# EAGLE design MoteBreakout (EAGLE 8.1.0)
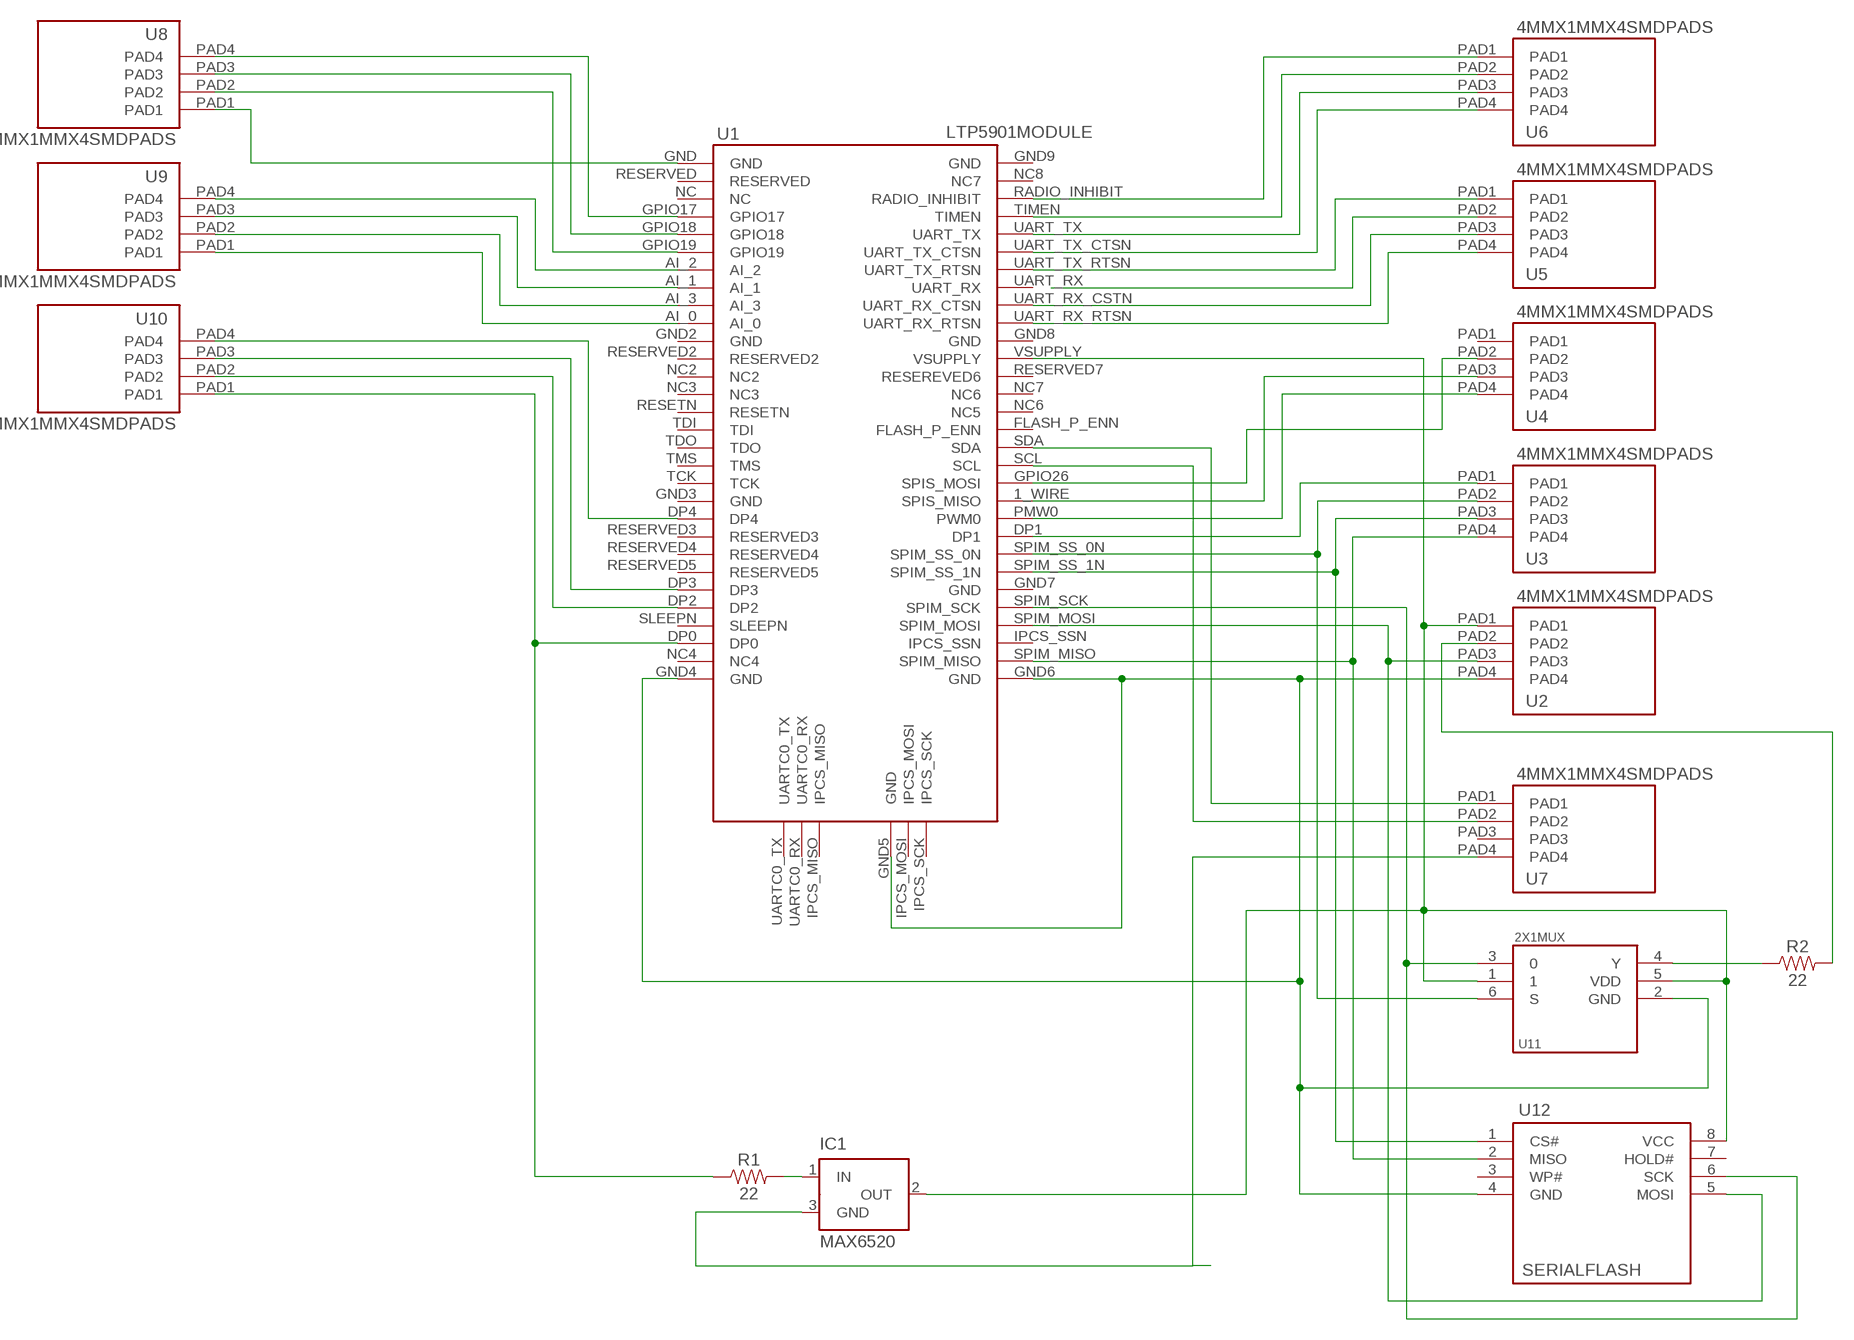
[diagram p0: schematic, sheet 1]

## Parts
IC1  MAX6520  [SOT23]
R1  22  22OHM-0603-1/10W-1%  [0603]
R2  22  22OHM-0603-1/10W-1%  [0603]
U1  LTP5901MODULE  [LTP5901]
U2  4MMX1MMX4SMDPADS  [4MMX1MMX4SMD]
U3  4MMX1MMX4SMDPADS  [4MMX1MMX4SMD]
U4  4MMX1MMX4SMDPADS  [4MMX1MMX4SMD]
U5  4MMX1MMX4SMDPADS  [4MMX1MMX4SMD]
U6  4MMX1MMX4SMDPADS  [4MMX1MMX4SMD]
U7  4MMX1MMX4SMDPADS  [4MMX1MMX4SMD]
U8  4MMX1MMX4SMDPADS  [4MMX1MMX4SMD]
U9  4MMX1MMX4SMDPADS  [4MMX1MMX4SMD]
U10  4MMX1MMX4SMDPADS  [4MMX1MMX4SMD]
U11  2X1MUX  [SOT457]
U12  SERIALFLASH  [8S2]

## Nets
N$1: U1.GND4(GND) U1.GND5(GND) U1.GND6(GND) U2.PAD4 U11.2(GND) U12.4(GND)
N$2: U1.SPIM_MOSI U2.PAD3 U12.5(MOSI)
N$3: U1.SPIM_SCK U11.3 U12.6(SCK)
N$4: IC1.2(OUT) U1.VSUPPLY U2.PAD1 U11.1 U11.5(VDD) U12.8(VCC)
N$5: U1.SPIM_MISO U3.PAD4 U12.2(MISO)
N$6: U1.SPIM_SS_1N U3.PAD3 U12.1(CS#)
N$7: U1.SPIM_SS_0N U3.PAD2 U11.6(S)
N$8: U1.DP1 U3.PAD1
N$9: U1.PMW0(PWM0) U4.PAD4
N$10: U1.1_WIRE(SPIS_MISO) U4.PAD3
N$11: U1.GPIO26(SPIS_MOSI) U4.PAD2
N$12: U1.UART_RX_RTSN U5.PAD4
N$13: U1.UART_RX_CSTN(UART_RX_CTSN) U5.PAD3
N$14: U5.PAD2
N$15: U1.UART_TX_RTSN U5.PAD1
N$16: U1.UART_TX_CTSN U6.PAD4
N$17: U1.UART_TX U6.PAD3
N$18: U1.TIMEN U6.PAD2
N$19: U1.RADIO_INHIBIT U6.PAD1
N$20: U1.GND U8.PAD1
N$21: U1.SDA U7.PAD1
N$22: U1.SCL U7.PAD2
N$23: IC1.3(GND) U7.PAD4
N$25: U1.GPIO17 U8.PAD4
N$26: U1.GPIO18 U8.PAD3
N$27: U1.GPIO19 U8.PAD2
N$28: U1.AI_2 U9.PAD4
N$29: U1.AI_1 U9.PAD3
N$30: U1.AI_3 U9.PAD2
N$31: U1.AI_0 U9.PAD1
N$32: U1.DP4 U10.PAD4
N$33: U1.DP3 U10.PAD3
N$34: U1.DP2 U10.PAD2
N$35: R1.1 U1.DP0 U10.PAD1
N$36: R2.2 U2.PAD2
N$37: R2.1 U11.4(Y)
N$39: IC1.1(IN) R1.2
Unconnected: U1.FLASH_P_ENN U1.IPCS_MISO U1.IPCS_MOSI U1.IPCS_SCK U1.IPCS_SSN U1.NC U1.NC2 U1.NC3 U1.NC4 U1.NC6(NC5) U1.NC7(NC6) U1.NC8(NC7) U1.RESERVED U1.RESERVED2 U1.RESERVED3 U1.RESERVED4 U1.RESERVED5 U1.RESERVED7(RESEREVED6) U1.RESETN U1.SLEEPN U1.TCK U1.TDI U1.TDO U1.TMS U1.UART_RX U1.UARTC0_RX U1.UARTC0_TX U4.PAD1 U7.PAD3 U12.3(WP#) U12.7(HOLD#)

## Power pins joined to a net without a drawn wire
GND: U1.GND2(GND) U1.GND3(GND) U1.GND7(GND) U1.GND8(GND) U1.GND9(GND)

## Library data of the parts
IC1 = maxim:MAX6520: 1.2V Voltage Reference 50ppm/°C, SOT23, 3-Terminal Source: Data sheet <http://datasheets.maxim-ic.com/en/ds/MAX6520.pdf>; MF: MAXIM; MPN: MAX6520EUR-T; OC_FARNELL: unknown; OC_NEWARK: 02J4586
R1 R2 = SparkFun-Resistors:22OHM: 22Ω resistor A resistor is a passive two-terminal electrical component that implements electrical resistance as a circuit element. Resistors act to reduce current flow, and, at the same time, act to lower voltage levels within circuits. - Wikipedia; PROD_ID: RES-08698
U1 = Dust:LTP5901: SmartMesh LTP5901 Module
U2-U10 = Dust:4MMX1MMX4SMD: 4mm x 1mm x 4 SMD Pads
U11 = nxp_60:2X1MUX: 2x1MUX - NXP 74LVC1G157
U12 = Dust:SERIALFLASH: Cypress S25FL116K Serial Flash

## Board
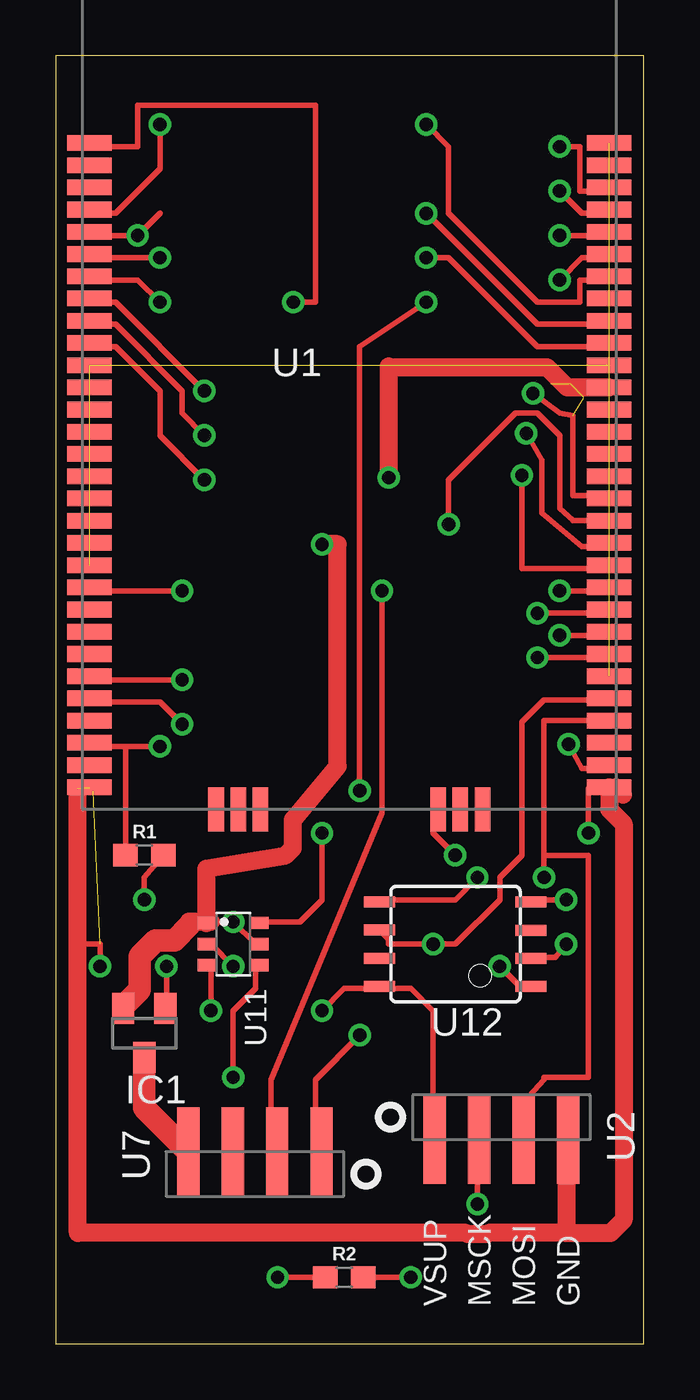
[diagram p1: board, top side]
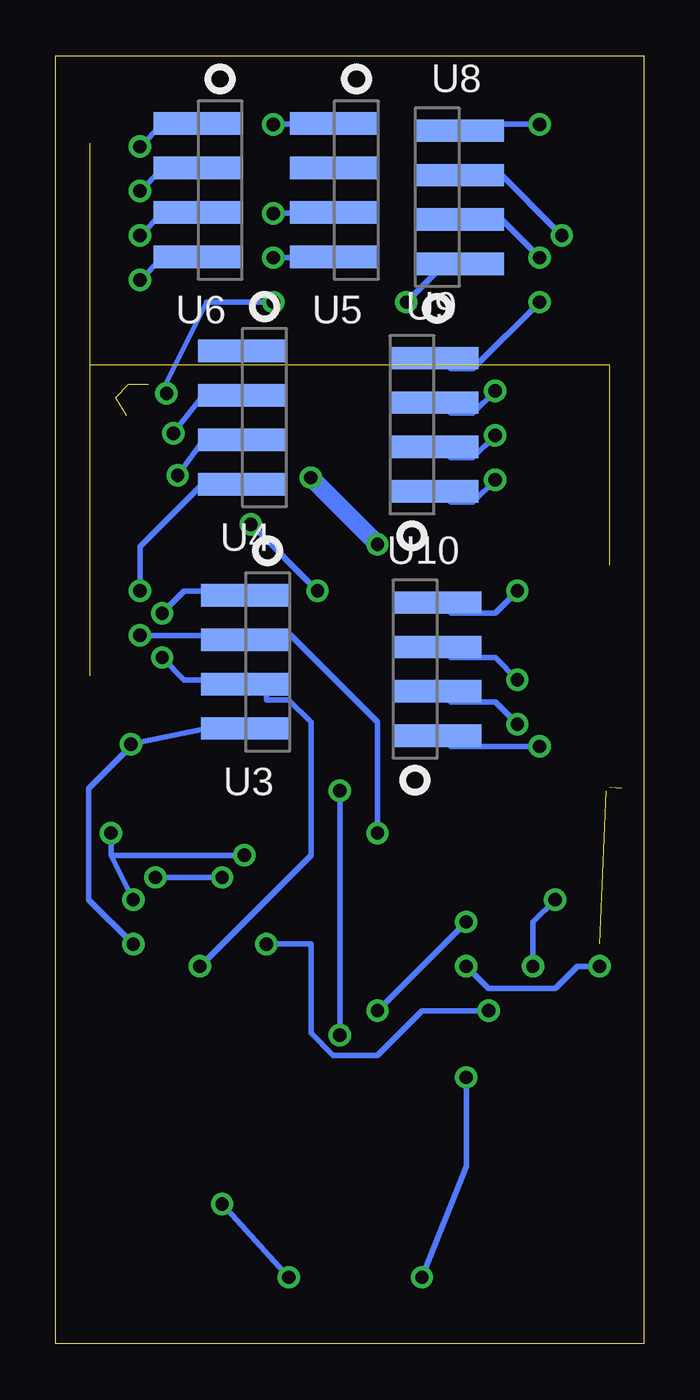
[diagram p2: board, bottom side, seen from below]

Size 26.5 x 58 mm. Coordinates in mm from the lower left corner, seen from the top.
Outline: 0,0 26.5,0 26.5,58 0,58 0,0
Copper layers (1*16): Top 0.035mm / dielectric 1.5mm / Bottom 0.035mm
Design rules "default *": minimum track width 10mil, minimum drill 12mil, track to track 6mil, track to pad 6mil, pad to pad 6mil, via to via 6mil, smd to smd 6mil, copper to edge 20mil, drill to drill 8mil, minimum pad ring 10mil, minimum via ring 8mil, stop-mask expansion 4mil, vias tented up to drill 0mil, thermal gap 10mil

### Footprints (pad centres in the part's own frame; a part is rotated, then mirrored left to right if it is on the bottom)
SOT23 = smd 1 x 1.4: 1 -0.95,-1.1; 2 0.95,-1.1; 3 0,1.1
0603 = smd 1.1 x 1: 1 -0.85,0; 2 0.85,0
LTP5901 = smd 2 x 0.7: 1_WIRE 11.7,-10; AI_0 -11.7,0; AI_1 -11.7,2; AI_2 -11.7,3; AI_3 -11.7,1; DP0 -11.7,-18; DP1 11.7,-12; DP2 -11.7,-16; DP3 -11.7,-15; DP4 -11.7,-11; FLASH_P_ENN 11.7,-6; GND -11.7,9; GND2 -11.7,-1; GND3 -11.7,-10; GND4 -11.7,-20; GND6 11.7,-20; GND7 11.7,-15; GND8 11.7,-1; GND9 11.7,9; GPIO17 -11.7,6; GPIO18 -11.7,5; GPIO19 -11.7,4; GPIO26 11.7,-9; IPCS_SSN 11.7,-18; NC -11.7,7; NC2 -11.7,-3; NC3 -11.7,-4; NC4 -11.7,-19; NC6 11.7,-5; NC7 11.7,-4; NC8 11.7,8; PMW0 11.7,-11; RADIO_INHIBIT 11.7,7; RESERVED -11.7,8; RESERVED2 -11.7,-2; RESERVED3 -11.7,-12; RESERVED4 -11.7,-13; RESERVED5 -11.7,-14; RESERVED7 11.7,-3; RESETN -11.7,-5; SCL 11.7,-8; SDA 11.7,-7; SLEEPN -11.7,-17; SPIM_MISO 11.7,-19; SPIM_MOSI 11.7,-17; SPIM_SCK 11.7,-16; SPIM_SS_0N 11.7,-13; SPIM_SS_1N 11.7,-14; TCK -11.7,-9; TDI -11.7,-6; TDO -11.7,-7; TIMEN 11.7,6; TMS -11.7,-8; UART_RX 11.7,2; UART_RX_CSTN 11.7,1; UART_RX_RTSN 11.7,0; UART_TX 11.7,5; UART_TX_CTSN 11.7,4; UART_TX_RTSN 11.7,3; VSUPPLY 11.7,-2 | smd 0.7 x 2: GND5 4,-21; IPCS_MISO -4,-21; IPCS_MOSI 5,-21; IPCS_SCK 6,-21; UARTC0_RX -5,-21; UARTC0_TX -6,-21
4MMX1MMX4SMD = smd 4 x 1: PAD1 -1,3; PAD2 -1,1; PAD3 -1,-1; PAD4 -1,-3
SOT457 = smd 0.55 x 0.8: 1 -0.95,-1.2; 2 0,-1.2; 3 0.95,-1.2; 4 0.95,1.2; 5 0,1.2; 6 -0.95,1.2
8S2 = smd 0.5 x 1.4: 1 -1.905,-3.404; 2 -0.645,-3.404; 3 0.625,-3.404; 4 1.895,-3.404; 5 1.905,3.404; 6 0.635,3.404; 7 -0.635,3.404; 8 -1.905,3.404

### Placement (x,y rotation side)
IC1  4,14 180 top
R1  4,22 0 top
R2  13,3 0 top
U1  13.23,45.06 0 top
U2  20.08,10.21 90 top
U3  16.95,30.7 0 bottom
U4  17.09,41.7 0 bottom
U5  12.95,51.94 0 bottom
U6  19.09,51.94 0 bottom
U7  8.98,7.65 270 top
U8  9.31,51.62 180 bottom
U9  10.45,41.38 180 bottom
U10  10.31,30.38 180 bottom
U11  8,18 270 top
U12  18,18 90 top

### Tracks (layer width: path | path; a pad name or v marks a point on that pad's centre or on a via)
GND  (4 unrouted)
N$1  (via drill 0.6)  (2 unrouted)
  Top 0.254: 1.7,24.9 U1.GND4 | 17.23,23.19 U1.GND5 17,24 17,23 v18,22 | v2,17 2,18 1,18 | v8,17 7,18 U11.2 | U1.GND6 24.06,25.06 24,25 v24,23 | v23,20 22,20 U12.4
  Top 0.813: 25.56,24.73 25.23,25.06 U1.GND6 24.93,24.07 25.59,23.41 25.59,5.59 25,5 23,5 | 23,5 19.5,5 19.44,4.94 18.56,4.94 18.5,5 1,5 1,25 | U2.PAD4 23,9.21 23,5
  Bottom 0.254: v2,17 3,17 4,16 7,16 v8,17 | v24,23 24,22 | 24,22 v23,20 | 24,22 v18,22
N$2  (via drill 0.6)
  Top 0.254: U1.SPIM_MOSI 22,28.06 22,22 | U2.PAD3 21.08,10.9 22,11.9 22,12 24,12 24,22 22,22 | v22,21 22,22 | U12.5 15,20 18,20 v19,21
  Bottom 0.254: v19,21 v22,21
N$3  (via drill 0.6)
  Top 0.254: U11.3 7,17 v7,15 | U12.6 15,18.23 15,18 v17,18 18,18 20,20 20,21 21,22 21,28 22,29 24.87,29 U1.SPIM_SCK
  Bottom 0.254: v7,15 10,15 12,13 14,13 15,14 15,18 v17,18
N$4  (via drill 0.6)
  Top 0.254: 24.96,43.33 U1.VSUPPLY | 3,15 IC1.2 | v12,15 13,16 14,16 U12.8 15,16 16,16 17,15 17,10 U2.PAD1 | 7,19 v8,19 9,18 U11.5
  Top 0.813: U1.VSUPPLY 23.04,43.06 22.14,43.96 15.04,43.96 15,44 v15,39 | v12,36 12.7,36 12.7,26 10.69,23.59 10.69,22.33 10.36,22 6.8,21.4 6.8,19.8 U11.1 7,19 6,19 6.03,18.84
  Top 1.016: IC1.2 3.05,15.2 3.79,15.94 3.79,17.43 4.52,18.16 5.36,18.16 6.03,18.84
  Bottom 0.254: v8,19 v12,15
  Bottom 0.813: v12,36 v15,39
N$5  (via drill 0.6)
  Top 0.254: v23.1,27 23.7,25.9 24.7,25.9 U1.SPIM_MISO | v23,18 22.5,17.4 21.45,17.4 U12.2
  Bottom 0.254: U3.PAD4 19.7,27.7 v23.1,27 23,27 25,25 25,20 v23,18
N$6  (via drill 0.6)
  Top 0.254: v21.7,30.9 24.7,30.9 U1.SPIM_SS_1N | v20,17 21,16 U12.1
  Bottom 0.254: v21.7,30.9 20.7,29.9 18.7,29.9 U3.PAD3 17,30 17,29 16,29 15,28 15,22 v20,17
N$7  (via drill 0.6)
  Top 0.254: U1.SPIM_SS_0N 24.7,31.9 v22.7,31.9 | U11.6 9,19 11,19 12,20 v12,23
  Bottom 0.254: v22.7,31.9 18.7,31.9 U3.PAD2 17,32 16,32 12,28 v12,23
N$8  (via drill 0.6)
  Top 0.254: v21.7,32.9 24.7,32.9 U1.DP1
  Bottom 0.254: v21.7,32.9 20.7,33.9 18.7,33.9 U3.PAD1
N$9  (via drill 0.6)
  Top 0.254: U1.PMW0 24.7,33.9 v22.7,33.9
  Bottom 0.254: v22.7,33.9 22.7,35.9 19.7,38.9 18.7,38.9 U4.PAD4
N$10  (via drill 0.6)
  Top 0.254: U1.1_WIRE 24.7,34.9 21,34.9 v21,39.1
  Bottom 0.254: v21,39.1 19.7,40.9 18.7,40.9 U4.PAD3
N$11  (via drill 0.6)
  Top 0.254: U1.GPIO26 24.7,35.9 23.7,35.9 21.9,37.4 21.9,39.8 v21.2,41
  Bottom 0.254: v21.2,41 19.7,42.9 18.7,42.9 U4.PAD2
N$12  (via drill 0.6)
  Top 0.254: U1.UART_RX_RTSN 24.7,44.9 21.7,44.9 17.7,48.9 v16.7,48.9
  Bottom 0.254: v16.7,48.9 14.7,48.9 U5.PAD4
N$13  (via drill 0.6)
  Top 0.254: U1.UART_RX_CSTN 24.7,45.9 21.7,45.9 v16.7,50.9
  Bottom 0.254: v16.7,50.9 14.7,50.9 U5.PAD3
N$15  (via drill 0.6)
  Top 0.254: U1.UART_TX_RTSN 24.7,47.9 23.6,47.9 23.6,46.9 21.7,46.9 17.7,50.9 17.7,53.9 v16.7,54.9
  Bottom 0.254: v16.7,54.9 14.7,54.9 U5.PAD1
N$16  (via drill 0.6)
  Top 0.254: U1.UART_TX_CTSN 24.7,48.9 23.7,48.9 v22.7,47.9
  Bottom 0.254: v22.7,47.9 21.7,48.9 20.7,48.9 U6.PAD4
N$17  (via drill 0.6)
  Top 0.254: v22.7,49.9 24.7,49.9 U1.UART_TX
  Bottom 0.254: v22.7,49.9 21.7,50.9 20.7,50.9 U6.PAD3
N$18  (via drill 0.6)
  Top 0.254: U1.TIMEN 24.7,50.9 23.7,50.9 v22.7,51.9
  Bottom 0.254: v22.7,51.9 21.7,52.9 20.7,52.9 U6.PAD2
N$19  (via drill 0.6)
  Top 0.254: U1.RADIO_INHIBIT 24.7,51.9 23.6,51.9 23.6,53.9 v22.7,53.9
  Bottom 0.254: v22.7,53.9 21.7,54.9 20.7,54.9 U6.PAD1
N$20  (via drill 0.6)
  Top 0.254: U1.GND 1.7,53.9 3.7,53.9 3.7,55.76 11.7,55.76 11.7,46.9 v10.7,46.9
  Bottom 0.254: v10.7,46.9 8.7,48.9 U8.PAD1
N$21  (via drill 0.6)  (3 unrouted)
  Top 0.254: U1.SDA 25.09,38.2 23.3,38.2 23.3,41.8 22.7,41.9 v21.5,42.8 | v16.7,46.9 13.7,44.9 v13.7,24.9 | v13.7,13.9 11.7,11.9 11.7,8.9 U7.PAD1
  Bottom 0.254: v16.7,46.9 19.7,46.9 21.7,42.9 v21.5,42.8 | v13.7,13.9 v13.7,24.9
N$22  (via drill 0.6)
  Top 0.254: v17.7,36.9 17.7,38.9 20.7,41.9 21.7,41.9 22.7,40.9 22.7,37.6 23.3,37.1 23.3,37.06 U1.SCL | v14.7,33.9 14.7,23.9 9.7,11.9 9.7,8.9 U7.PAD2
  Bottom 0.254: v14.7,33.9 v17.7,36.9
N$23
  Top 1.016: IC1.3 4,10.63 U7.PAD4
N$25  (via drill 0.6)
  Top 0.254: U1.GPIO17 1.7,50.9 2.7,50.9 4.7,52.9 v4.7,54.9
  Bottom 0.254: v4.7,54.9 7.7,54.9 U8.PAD4
N$26  (via drill 0.6)
  Top 0.254: U1.GPIO18 1.7,49.9 v3.7,49.9 4.7,50.9
  Bottom 0.254: v3.7,49.9 6.7,52.9 7.7,52.9 U8.PAD3
N$27  (via drill 0.6)
  Top 0.254: U1.GPIO19 1.7,48.9 v4.7,48.9
  Bottom 0.254: v4.7,48.9 6.7,50.9 7.7,50.9 U8.PAD2
N$28  (via drill 0.6)
  Top 0.254: U1.AI_2 1.7,47.9 3.7,47.9 v4.7,46.9
  Bottom 0.254: v4.7,46.9 7.7,43.9 8.7,43.9 U9.PAD4
N$29  (via drill 0.6)
  Top 0.254: U1.AI_1 1.7,46.9 2.7,46.9 v6.7,42.9
  Bottom 0.254: v6.7,42.9 7.7,41.9 8.7,41.9 U9.PAD3
N$30  (via drill 0.6)
  Top 0.254: U1.AI_3 1.7,45.9 2.7,45.9 5.7,42.9 5.7,41.9 v6.7,40.9
  Bottom 0.254: v6.7,40.9 7.7,39.9 8.7,39.9 U9.PAD2
N$31  (via drill 0.6)
  Top 0.254: U1.AI_0 1.7,44.9 2.7,44.9 4.7,42.9 4.7,40.9 v6.7,38.9
  Bottom 0.254: v6.7,38.9 7.7,37.9 8.7,37.9 U9.PAD1
N$32  (via drill 0.6)
  Top 0.254: v5.7,33.9 1.7,33.9 U1.DP4
  Bottom 0.254: v5.7,33.9 6.7,32.9 8.7,32.9 U10.PAD4
N$33  (via drill 0.6)
  Top 0.254: v5.7,29.9 1.7,29.9 U1.DP3
  Bottom 0.254: v5.7,29.9 6.7,30.9 8.7,30.9 U10.PAD3
N$34  (via drill 0.6)
  Top 0.254: U1.DP2 1.7,28.9 4.7,28.9 v5.7,27.9
  Bottom 0.254: v5.7,27.9 6.7,28.9 8.7,28.9 U10.PAD2
N$35  (via drill 0.6)
  Top 0.254: 3.15,26.9 v4.7,26.9 | U1.DP0 1.7,26.9 3,26.9 3.15,26.9 | 3.15,26.9 R1.1
  Bottom 0.254: v4.7,26.9 8.7,26.9 U10.PAD1
N$36  (via drill 0.6)
  Top 0.254: v16,3 R2.2 | v19,6.3 19,9 U2.PAD2
  Bottom 0.254: v19,6.3 v16,3
N$37  (via drill 0.6)
  Top 0.254: v8,12 8,15 9,16 9,17 U11.4 | R2.1 v10,3
  Bottom 0.254: v8,12 8,8 v10,3
N$39  (via drill 0.6)
  Top 0.254: v4,20 4,21 R1.2 | v5,17 5,15 IC1.1
  Bottom 0.254: v5,17 5,19 v4,20

### Text on the board
tNames: VSUP | MSCK | MOSI | GND